# Altium schematic sheet Measurements.SchDoc
size A3; DocumentNumber: 6; SheetNumber: 6; SheetTotal: 6
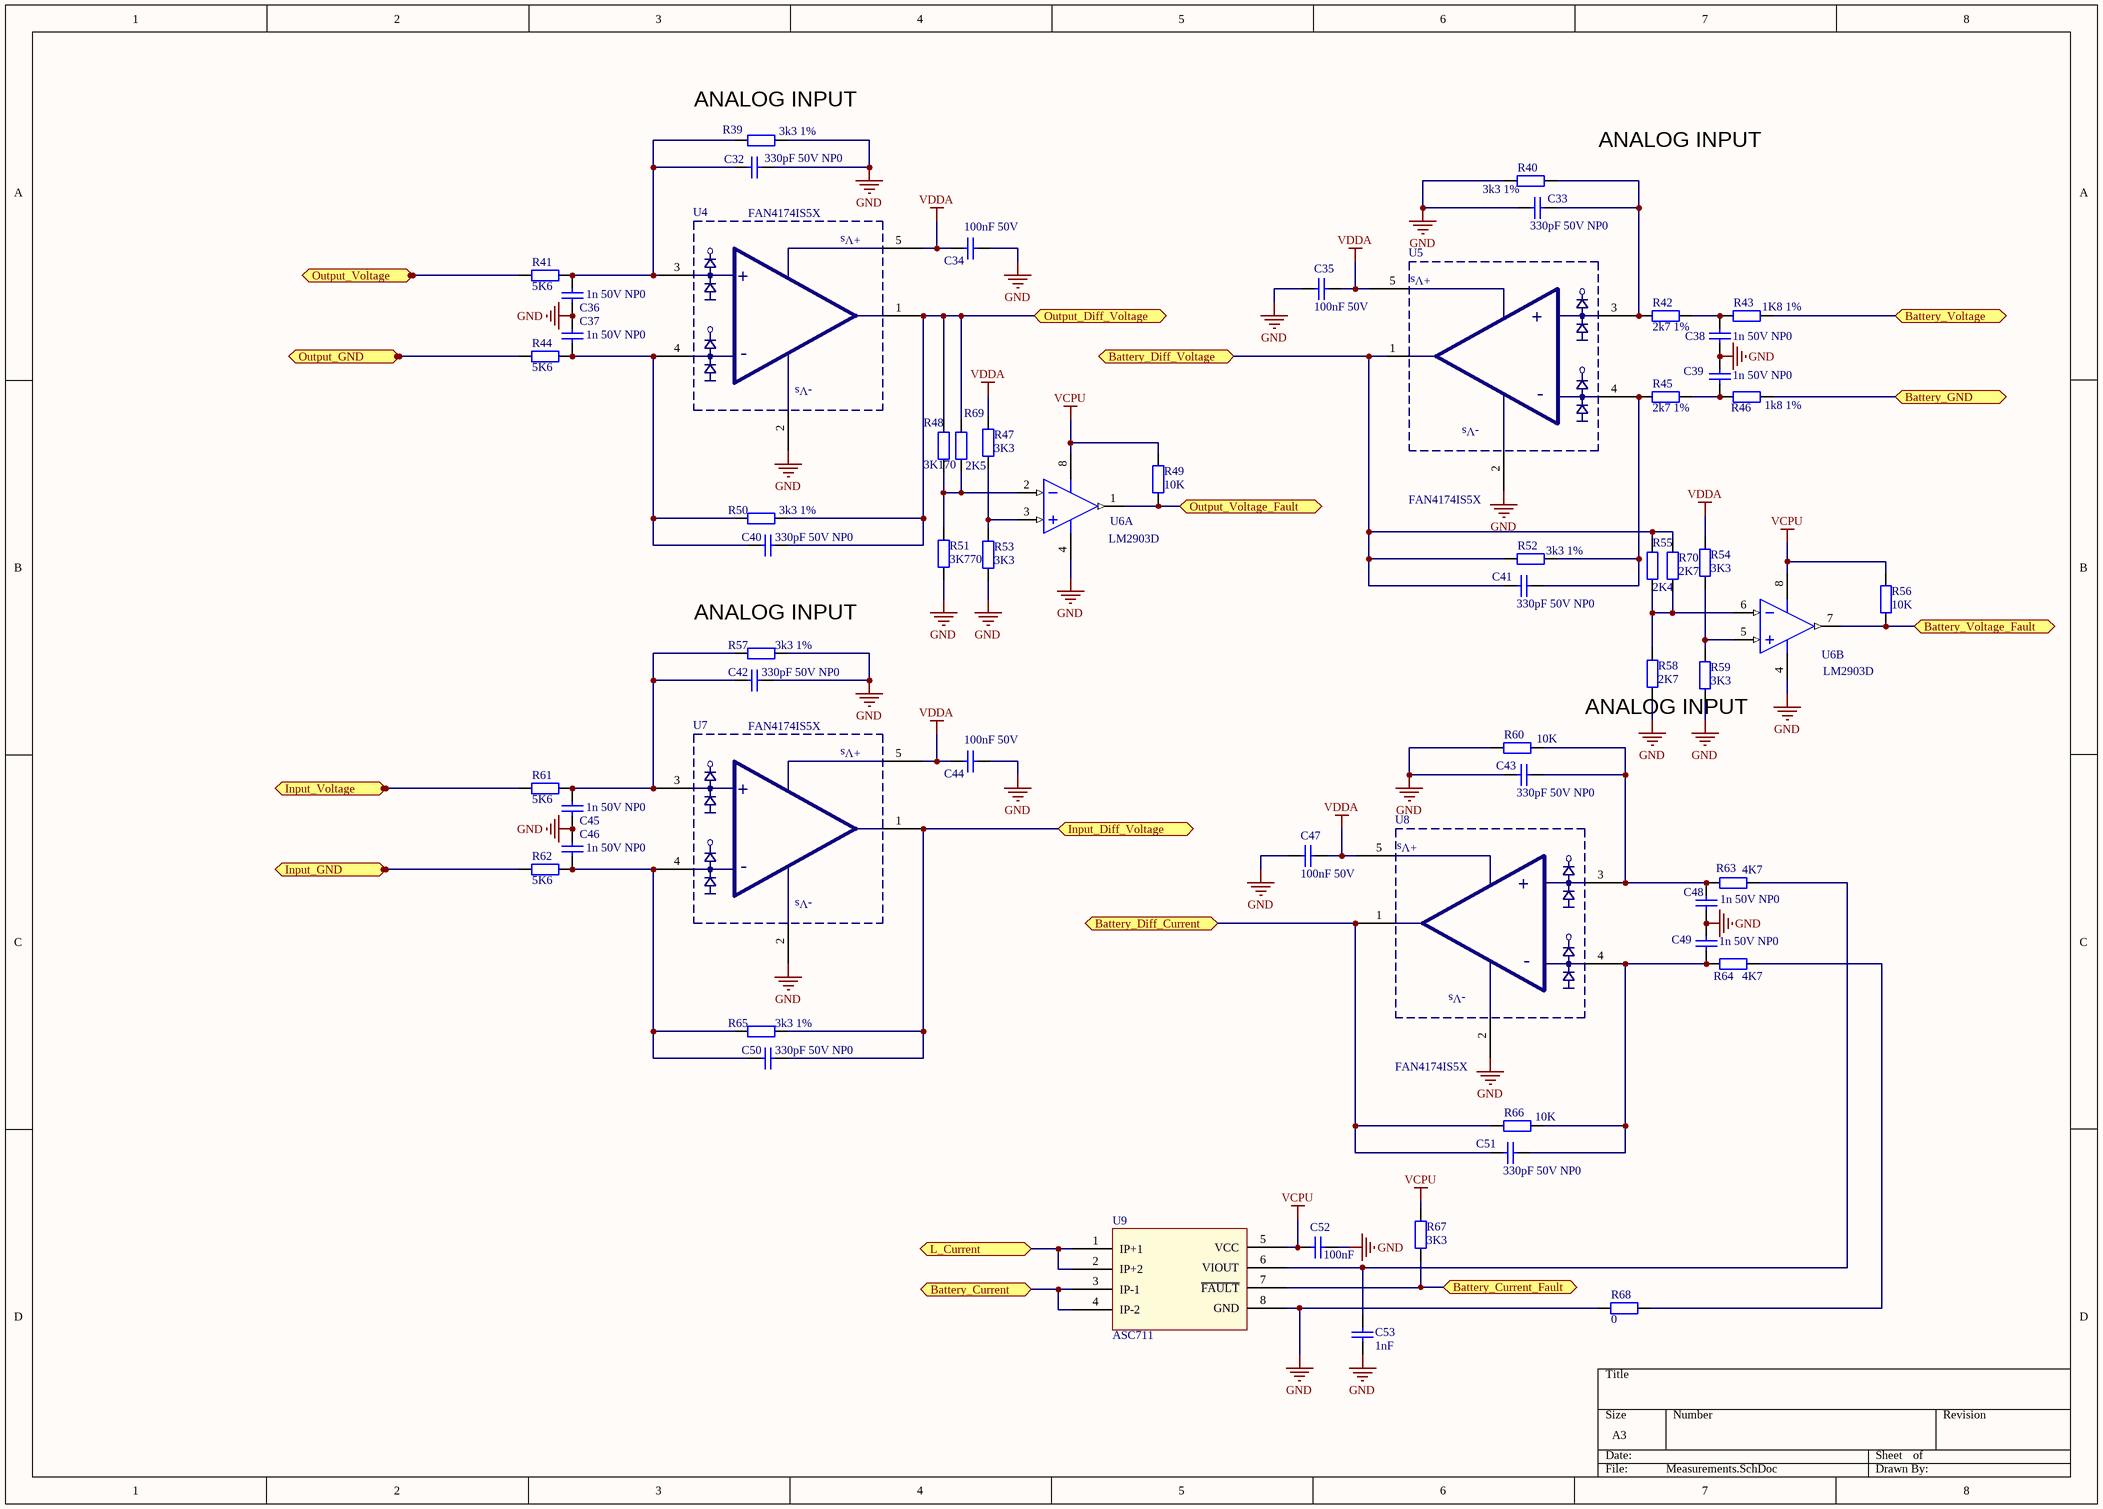
[diagram p0: Measurements.SchDoc]

## Parts
C32  330pF 50V NP0  [0805_C]
C33  330pF 50V NP0  [0805_C]
C34  100nF 50V  [0805_C]
C35  100nF 50V  [0805_C]
C36  1n 50V NP0  [FP_0805_CAP_085]
C37  1n 50V NP0  [FP_0805_CAP_085]
C38  1n 50V NP0  [FP_0805_CAP_085]
C39  1n 50V NP0  [FP_0805_CAP_085]
C40  330pF 50V NP0  [0805_C]
C41  330pF 50V NP0  [0805_C]
C42  330pF 50V NP0  [0805_C]
C43  330pF 50V NP0  [0805_C]
C44  100nF 50V  [0805_C]
C45  1n 50V NP0  [FP_0805_CAP_085]
C46  1n 50V NP0  [FP_0805_CAP_085]
C47  100nF 50V  [0805_C]
C48  1n 50V NP0  [FP_0805_CAP_085]
C49  1n 50V NP0  [FP_0805_CAP_085]
C50  330pF 50V NP0  [0805_C]
C51  330pF 50V NP0  [0805_C]
C52  100nF  [FP_0805_CAP_085]
C53  1nF  [FP_0805_CAP_085]
R39  3k3 1%  [FP_0805_RES]
R40  3k3 1%  [FP_0805_RES]
R41  5K6  [FP_0805_RES]
R42  2k7 1%  [FP_0805_RES]
R43  1K8 1%  [FP_0805_RES]
R44  5K6  [FP_0805_RES]
R45  2k7 1%  [FP_0805_RES]
R46  1k8 1%  [FP_0805_RES]
R47  3K3  [FP_0805_RES]
R48  3K170  [FP_0805_RES]
R49  10K  [FP_0805_RES]
R50  3k3 1%  [FP_0805_RES]
R51  3K770  [FP_0805_RES]
R52  3k3 1%  [FP_0805_RES]
R53  3K3  [FP_0805_RES]
R54  3K3  [FP_0805_RES]
R55  2K4  [FP_0805_RES]
R56  10K  [FP_0805_RES]
R57  3k3 1%  [FP_0805_RES]
R58  2K7  [FP_0805_RES]
R59  3K3  [FP_0805_RES]
R60  10K  [FP_0805_RES]
R61  5K6  [FP_0805_RES]
R62  5K6  [FP_0805_RES]
R63  4K7  [FP_0805_RES]
R64  4K7  [FP_0805_RES]
R65  3k3 1%  [FP_0805_RES]
R66  10K  [FP_0805_RES]
R67  3K3  [FP_0805_RES]
R68  0  [FP_0805_0ohm]
R69  2K5  [FP_0805_RES]
R70  2K7  [FP_0805_RES]
U4  FAN4174IS5X  [SOT-23-5]
U5  FAN4174IS5X  [SOT-23-5]
U6  LM2903D  [FP_SO8_MS012AA]  (parts A,B of 2)
U7  FAN4174IS5X  [SOT-23-5]
U8  FAN4174IS5X  [SOT-23-5]
U9  ASC711  [SOP8]

## Ports
Battery_Current, Battery_Current_Fault, Battery_Diff_Current, Battery_Diff_Voltage, Battery_GND, Battery_Voltage, Battery_Voltage_Fault, Input_Diff_Voltage, Input_GND, Input_Voltage, L_Current, Output_Diff_Voltage, Output_GND, Output_Voltage, Output_Voltage_Fault

## Nets
GND: C32.2 C33.2 C34.1 C35.1 C36.1 C37.2 C38.1 C39.2 C42.2 C43.2 C44.1 C45.1 C46.2 C47.1 C48.1 C49.2 C52.2 C53.1 R39.1 R40.1 R51.1 R53.1 R57.1 R58.1 R59.1 R60.1 R68.1 U4.2(-Vs) U5.2(-Vs) U6.4(GND) U7.2(-Vs) U8.2(-Vs) U9.8(GND)
VCPU: C52.1 R49.2 R56.2 R67.2 U6.8(VCC) U9.5(VCC)
VDDA: C34.2 C35.2 C44.2 C47.2 R47.2 R54.2 U4.5(+Vs) U5.5(+Vs) U7.5(+Vs) U8.5(+Vs)
Battery_Current: U9.3(IP-1) U9.4(IP-2) ; port Battery_Current
Battery_Current_Fault: R67.1 U9.7(~{FAULT}) ; port Battery_Current_Fault
Battery_Diff_Current: C51.2 R66.1 U8.1(OUT) ; port Battery_Diff_Current
Battery_Diff_Voltage: C41.2 R52.1 R55.2 R70.2 U5.1(OUT) ; port Battery_Diff_Voltage
Battery_GND: R46.2 ; port Battery_GND
Battery_Voltage: R43.2 ; port Battery_Voltage
Battery_Voltage_Fault: R56.1 U6.7(OUT2) ; port Battery_Voltage_Fault
Input_Diff_Voltage: C50.2 R65.1 U7.1(OUT) ; port Input_Diff_Voltage
Input_GND: R62.1 ; port Input_GND
Input_Voltage: R61.1 ; port Input_Voltage
L_Current: U9.1(IP+1) U9.2(IP+2) ; port L_Current
Output_Diff_Voltage: C40.2 R48.2 R50.1 R69.2 U4.1(OUT) ; port Output_Diff_Voltage
Output_GND: R44.1 ; port Output_GND
Output_Voltage: R41.1 ; port Output_Voltage
Output_Voltage_Fault: R49.1 U6.1(OUT1) ; port Output_Voltage_Fault
NetC32_1: C32.1 C36.2 R39.2 R41.2 U4.3(+IN)
NetC33_1: C33.1 R40.2 R42.1 U5.3(+IN)
NetC37_1: C37.1 C40.1 R44.2 R50.2 U4.4(-IN)
NetC38_2: C38.2 R42.2 R43.1
NetC39_1: C39.1 R45.2 R46.1
NetC41_1: C41.1 R45.1 R52.2 U5.4(-IN)
NetC42_1: C42.1 C45.2 R57.2 R61.2 U7.3(+IN)
NetC43_1: C43.1 C48.2 R60.2 R63.1 U8.3(+IN)
NetC46_1: C46.1 C50.1 R62.2 R65.2 U7.4(-IN)
NetC49_1: C49.1 C51.1 R64.1 R66.2 U8.4(-IN)
NetC53_2: C53.2 R63.2 U9.6(VIOUT)
NetR47_1: R47.1 R53.2 U6.3(IN1+)
NetR48_1: R48.1 R51.2 R69.1 U6.2(IN1-)
NetR54_1: R54.1 R59.2 U6.5(IN2+)
NetR55_1: R55.1 R58.2 R70.1 U6.6(IN2-)
NetR64_2: R64.2 R68.2

## Notes on the sheet
- (near R39) ANALOG INPUT
- (near R40) ANALOG INPUT
- (near R57) ANALOG INPUT
- (near R60) ANALOG INPUT
- (in symbol FAN4174IS5X) +; -

## Library data of the parts
C32 C33 C40-C43 C50 C51 = Capacitor_SMD: SMD kondenzátorok; CompType: CC0805JRNP09BN331; Distributor: Lomex; Order Code: 82-01-07; Package: 0805; Part Class: Capacitor; Value: 330pF 50V NP0
C34 C35 C44 C47 = Capacitor_SMD: SMD kondenzátorok; CompType: CC0805KPX7R9BB104; Note: 10% X7R; Distributor: Lomex; Order Code: 82-07-32; Package: 0805; Part Class: Capacitor; Value: 100nF 50V
C36-C39 C45 C46 C48 C49 = Capacitor: CompType: CC0805JRNP09BN102; Distributor: Lomex; Order Code: 82-01-13; Package: 0805; Part Class: Capacitor; Value: 1n 50V NP0
C52 C53 = CAP: Capacitor
  C52: Value: 100nF; Lomex NR: 82-07-32
  C53: Value: 1nF
R39 R40 R50 R52 R57 R60 R65 R66 = Resistor: CompType: CR-05FL7---3K3; Distributor: Lomex; Order Code: 80-10-92; Package: 0805; Part Class: Resistor
  R39 R40 R50 R52 R57 R65: Value: 3k3 1%
  R60 R66: Value: 10K
R41 R44 R47-R49 R51 R53-R56 R58 R59 R61-R64 R67-R70 = RES: Resistor
  R41 R44 R61 R62: Value: 5K6
  R47 R53 R54 R59 R67: Value: 3K3
  R48: Value: 3K170
  R49 R56: Value: 10K
  R51: Value: 3K770
  R55: Value: 2K4
  R58 R70: Value: 2K7
  R63 R64: Value: 4K7
  R68: Value: 0
  R69: Value: 2K5
R42 R45 = Resistor: CompType: CR-05FL7---2K7; Distributor: Lomex; Order Code: 80-10-91; Package: 0805; Part Class: Resistor; Value: 2k7 1%
R43 R46 = Resistor: CompType: CR-05FL7---2K4; Distributor: Lomex; Order Code: 80-14-00; Package: 0805; Part Class: Resistor
  R43: Value: 1K8 1%
  R46: Value: 1k8 1%
U4 U5 U7 U8 = FAN4174IS5X: OrderCode: 671-1166; CompType: FAN4174IS5X; Distributor: RS components; Package: SOT-23-5
U6 = LM2903D: komparátor
U9 = ASC711: Árammérő